# EAGLE design Focus_V7 (EAGLE 6.3)
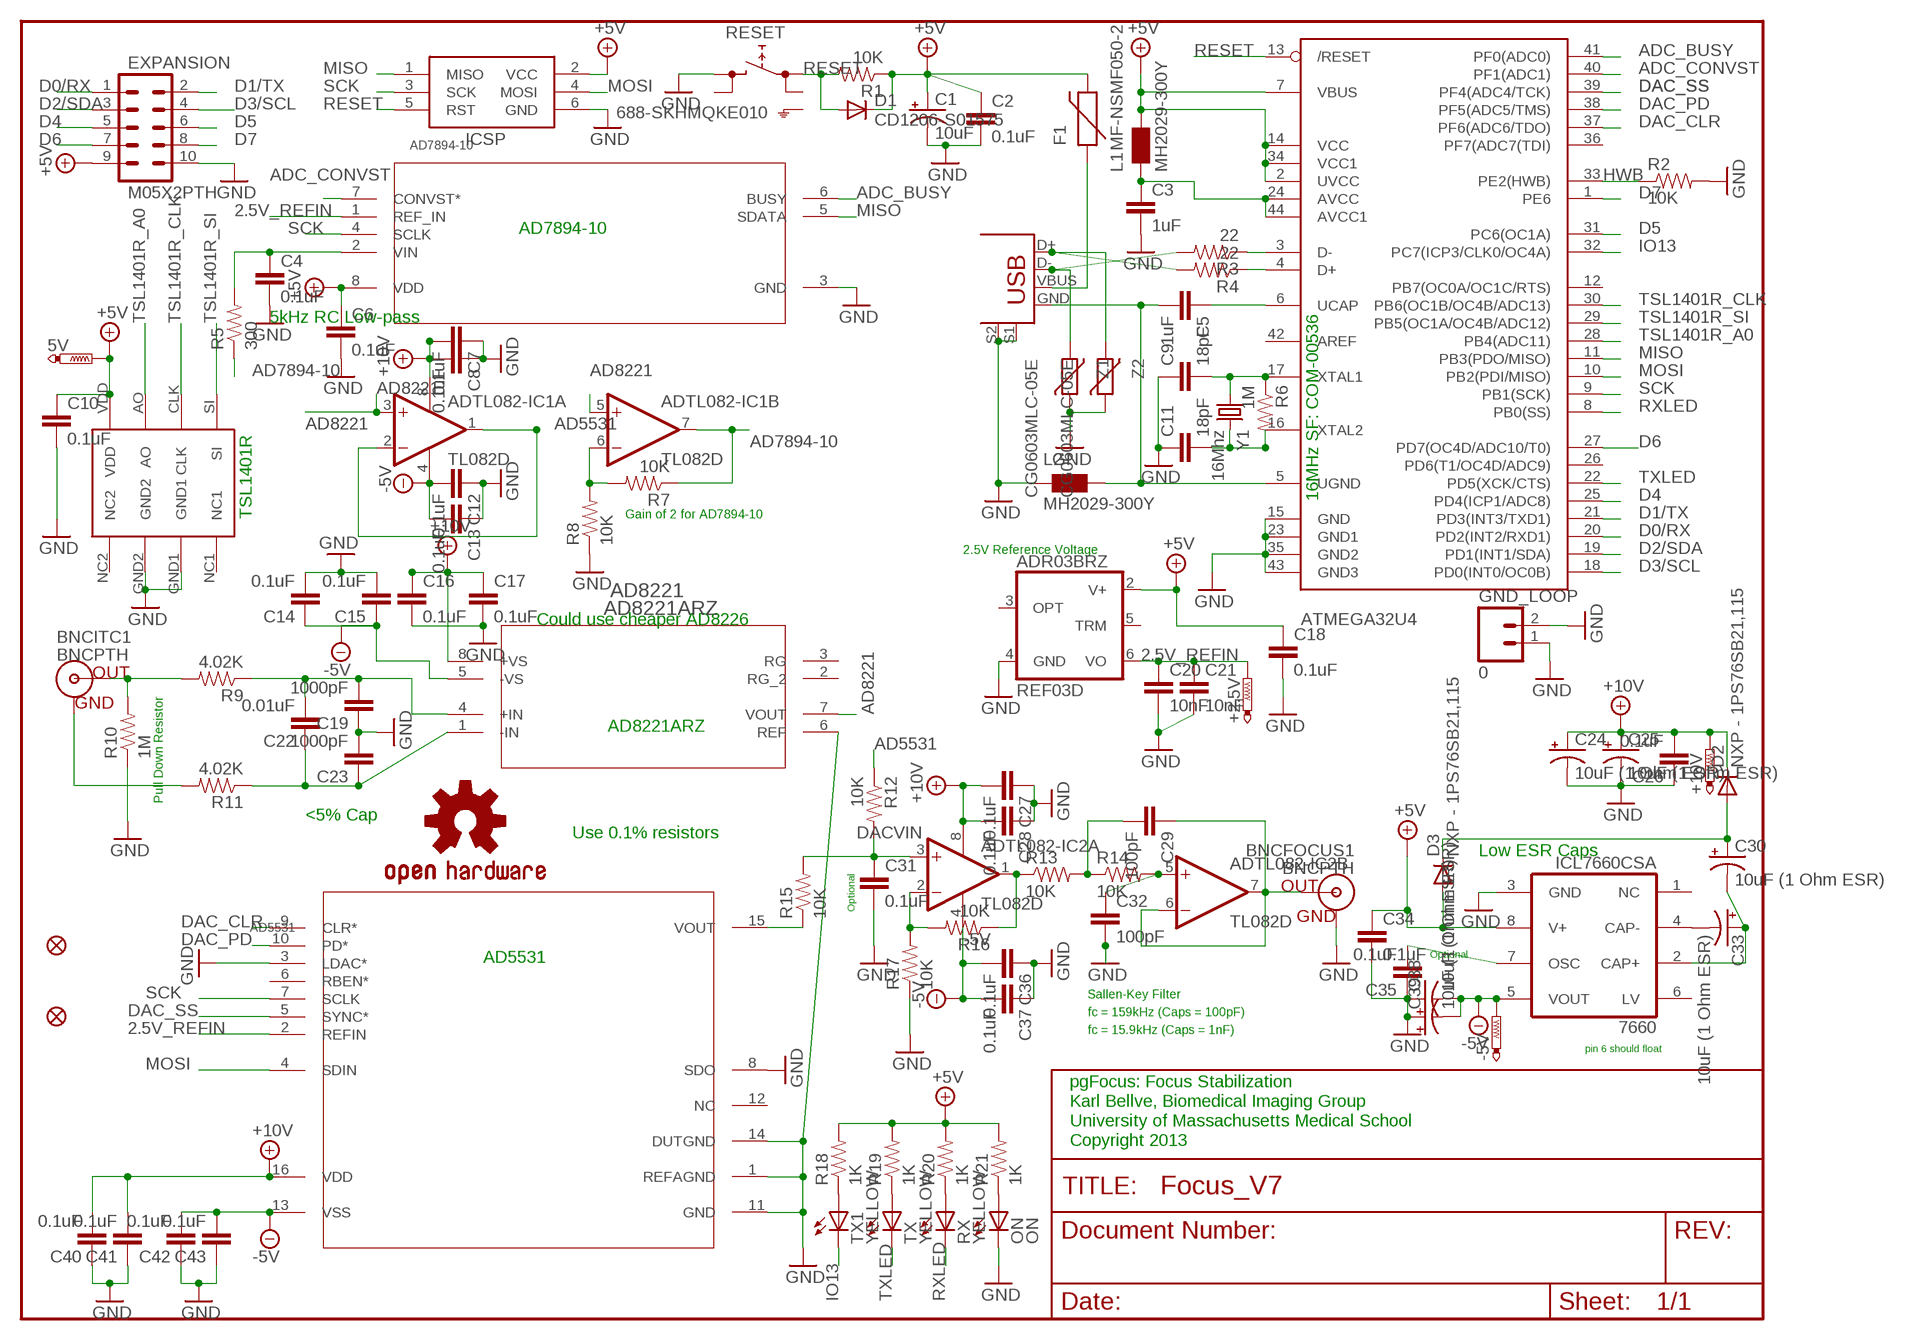
[diagram p0: schematic, sheet 1]

## Parts
5V  PTR1TP20R  [TP20R]
7660  ICL7660CSA  [SO08]
+2.5V  PTR1TP20R  [TP20R]
+10V  PTR1TP20R  [TP20R]
-5V  PTR1TP20R  [TP20R]
AD5531  AD5531BRUZ  [RU_16]
AD7894-10  AD7894ARZ-10  AD7894ARZ-3  [R_8]
AD8221  AD8221ARZ  [R_8]
ADR03BRZ  REF03D  [SO08]
ADTL082-IC1  TL082D  [SO08]
ADTL082-IC2  TL082D  [SO08]
ATMEGA32U4  ATMEGA32U4-AU  [TQFP44]
BNCFOCUS1  BNCPTH  [BNC]
BNCITC1  BNCPTH  [BNC]
C1  10uF  CAP_POL1206-KIT  [EIA3216-KIT]
C2  0.1uF  CAP0603-CAP  [0603-CAP]
C3  1uF  CAP0603-CAP  [0603-CAP]
C4  0.1uF  CAP0603-CAP  [0603-CAP]
C5  1uF  CAP0603-CAP  [0603-CAP]
C6  0.1uF  CAP0603-CAP  [0603-CAP]
C7  0.1uF  CAP0603-CAP  [0603-CAP]
C8  0.1uF  CAP0603-CAP  [0603-CAP]
C9  18pF  CAP0603-CAP  [0603-CAP]
C10  0.1uF  CAP0603-CAP  [0603-CAP]
C11  18pF  CAP0603-CAP  [0603-CAP]
C12  0.1uF  CAP0603-CAP  [0603-CAP]
C13  0.1uF  CAP0603-CAP  [0603-CAP]
C14  0.1uF  CAP0603-CAP  [0603-CAP]
C15  0.1uF  CAP0603-CAP  [0603-CAP]
C16  0.1uF  CAP0603-CAP  [0603-CAP]
C17  0.1uF  CAP0603-CAP  [0603-CAP]
C18  0.1uF  CAP0603-CAP  [0603-CAP]
C19  1000pF  CAP0603-CAP  [0603-CAP]
C20  10nF  CAP0603-CAP  [0603-CAP]
C21  10nF  CAP0603-CAP  [0603-CAP]
C22  0.01uF  CAP0603-CAP  [0603-CAP]
C23  1000pF  CAP0603-CAP  [0603-CAP]
C24  10uF (1 Ohm ESR)  CAP_POL1206-KIT  [EIA3216-KIT]
C25  10uF (1 Ohm ESR)  CAP_POL1206-KIT  [EIA3216-KIT]
C26  0.1uF  CAP0603-CAP  [0603-CAP]
C27  0.1uF  CAP0603-CAP  [0603-CAP]
C28  0.1uF  CAP0603-CAP  [0603-CAP]
C29  100pF  CAP0603-CAP  [0603-CAP]
C30  10uF (1 Ohm ESR)  CAP_POL1206-KIT  [EIA3216-KIT]
C31  0.1uF  CAP0603-CAP  [0603-CAP]
C32  100pF  CAP0603-CAP  [0603-CAP]
C33  10uF (1 Ohm ESR)  CAP_POL1206-KIT  [EIA3216-KIT]
C34  0.1uF  CAP0603-CAP  [0603-CAP]
C35  0.1uF  CAP0603-CAP  [0603-CAP]
C36  0.1uF  CAP0603-CAP  [0603-CAP]
C37  0.1uF  CAP0603-CAP  [0603-CAP]
C38  10uF (1 Ohm ESR)  CAP_POL1206-KIT  [EIA3216-KIT]
C39  10uF (1 Ohm ESR)  CAP_POL1206-KIT  [EIA3216-KIT]
C40  0.1uF  CAP0603-CAP  [0603-CAP]
C41  0.1uF  CAP0603-CAP  [0603-CAP]
C42  0.1uF  CAP0603-CAP  [0603-CAP]
C43  0.1uF  CAP0603-CAP  [0603-CAP]
D1  CD1206-S01575  DIODE-MINIMELF  [MINIMELF]
D2  NXP - 1PS76SB21,115  DIODESOD  [SOD-323]
D3  NXP - 1PS76SB21,115  DIODESOD  [SOD-323]
EXPANSION  M05X2PTH  [AVR_ICSP]
F1  MF-NSMF050-2  PTCSMD  [PTC-1206]
GND_LOOP  0  M02NG  [1X02]
ICSP  AVRISP-6  [AVRISP]
JP1  FIDUCIAL1.5X3  [FIDUCIAL-1.5X3]
JP2  FIDUCIAL1.5X3  [FIDUCIAL-1.5X3]
L1  MH2029-300Y  WE-CBF_0805  [0805]
L2  MH2029-300Y  WE-CBF_0805  [0805]
ON  ON  LEDCHIPLED_0805  [CHIPLED_0805]
R1  10K  RESISTOR0603-RES  [0603-RES]
R2  10K  RESISTOR0603-RES  [0603-RES]
R3  22  RESISTOR0603-RES  [0603-RES]
R4  22  RESISTOR0603-RES  [0603-RES]
R5  300  RESISTOR0603-RES  [0603-RES]
R6  1M  RESISTOR0603-RES  [0603-RES]
R7  10K  RESISTOR0603-RES  [0603-RES]
R8  10K  RESISTOR0603-RES  [0603-RES]
R9  4.02K  RESISTOR0603-RES  [0603-RES]
R10  1M  RESISTOR0603-RES  [0603-RES]
R11  4.02K  RESISTOR0603-RES  [0603-RES]
R12  10K  RESISTOR0603-RES  [0603-RES]
R13  10K  RESISTOR0603-RES  [0603-RES]
R14  10K  RESISTOR0603-RES  [0603-RES]
R15  10K  RESISTOR0603-RES  [0603-RES]
R16  10K  RESISTOR0603-RES  [0603-RES]
R17  10K  RESISTOR0603-RES  [0603-RES]
R18  1K  RESISTOR0603-RES  [0603-RES]
R19  1K  RESISTOR0603-RES  [0603-RES]
R20  1K  RESISTOR0603-RES  [0603-RES]
R21  1K  RESISTOR0603-RES  [0603-RES]
RESET  688-SKHMQKE010  SKHMPSE010  [SKHMPXE010]
RX  YELLOW  LEDCHIPLED_0805  [CHIPLED_0805]
TX  YELLOW  LEDCHIPLED_0805  [CHIPLED_0805]
TX1  YELLOW  LEDCHIPLED_0805  [CHIPLED_0805]
U$1  TSL1401CL  [TSL1401CL]
U$3  OSHW-LOGOL  [OSHW-LOGO-L]
X1  USB+SHIELD  [USB-B-PTH]
Y1  16Mhz  CRYSTALHC49UV  [HC49U-V]
Z1  CG0603MLC-05E  VARISTORCN0603  [CT/CN0603]
Z2  CG0603MLC-05E  VARISTORCN0603  [CT/CN0603]

## Nets
2.5V_REFIN: +2.5V.TP AD5531.2(REFIN) AD7894-10.1(REF_IN) ADR03BRZ.6(VO) C20.1 C21.1
+5V: 5V.TP 7660.8(V+) AD7894-10.8(VDD) ADR03BRZ.2(V+) ATMEGA32U4.2(UVCC) ATMEGA32U4.7(VBUS) ATMEGA32U4.14(VCC) ATMEGA32U4.34(VCC1) C1.A(+) C2.1 C6.1 C10.1 C18.1 C34.1 D1.C D3.2(A) EXPANSION.9 F1.2 ICSP.2(VCC) L1.2 R1.1 R18.2 R19.2 R20.2 R21.2 U$1.VDD
+10V: +10V.TP AD5531.16(VDD) AD8221.8(+VS) ADTL082-IC1.8(P:V+) ADTL082-IC2.8(P:V+) C7.2 C8.2 C16.1 C17.1 C24.A(+) C25.A(+) C26.2 C27.2 C28.2 C40.2 C41.2 D2.1(C)
-5V: 7660.5(VOUT) -5V.TP AD5531.13(VSS) AD8221.5(-VS) ADTL082-IC1.4(P:V-) ADTL082-IC2.4(P:V-) C12.2 C13.2 C14.1 C15.1 C36.2 C37.2 C38.C(-) C39.C(-) C42.2 C43.2
AD5531: ADTL082-IC1.1(A:OUT) ADTL082-IC1.2(A:-IN) R12.1
AD7894-10: ADTL082-IC1.7(B:OUT) R5.1 R7.1
AD8221: AD8221.7(VOUT) ADTL082-IC1.3(A:+IN) ADTL082-IC1.5(B:+IN)
ADC_BUSY: AD7894-10.6(BUSY) ATMEGA32U4.41(PF0(ADC0))
ADC_CONVST: AD7894-10.7(CONVST*) ATMEGA32U4.40(PF1(ADC1))
D0/RX: ATMEGA32U4.20(PD2(INT2/RXD1)) EXPANSION.1
D1/TX: ATMEGA32U4.21(PD3(INT3/TXD1)) EXPANSION.2
D2/SDA: ATMEGA32U4.19(PD1(INT1/SDA)) EXPANSION.3
D3/SCL: ATMEGA32U4.18(PD0(INT0/OC0B)) EXPANSION.4
D4: ATMEGA32U4.25(PD4(ICP1/ADC8)) EXPANSION.5
D5: ATMEGA32U4.31(PC6(OC1A)) EXPANSION.6
D6: ATMEGA32U4.27(PD7(OC4D/ADC10/T0)) EXPANSION.7
D7: ATMEGA32U4.1(PE6) EXPANSION.8
DAC_CLR: AD5531.9(CLR*) ATMEGA32U4.37(PF6(ADC6/TDO))
DAC_PD: AD5531.10(PD*) ATMEGA32U4.38(PF5(ADC5/TMS))
DAC_SS: AD5531.5(SYNC*) ATMEGA32U4.39(PF4(ADC4/TCK))
DACVIN: ADTL082-IC2.3(A:+IN) C31.1 R12.2 R15.2
GND: 7660.3(GND) AD5531.1(REFAGND) AD5531.3(LDAC*) AD5531.8(SDO) AD5531.11(GND) AD5531.14(DUTGND) AD7894-10.3(GND) AD8221.6(REF) ADR03BRZ.4(GND) ATMEGA32U4.15(GND) ATMEGA32U4.23(GND1) ATMEGA32U4.35(GND2) ATMEGA32U4.43(GND3) BNCFOCUS1.GND C1.C(-) C2.2 C3.2 C4.2 C6.2 C7.1 C8.1 C9.1 C10.2 C11.1 C12.1 C13.1 C14.2 C15.2 C16.2 C17.2 C18.2 C19.1 C20.2 C21.2 C23.2 C24.C(-) C25.C(-) C26.1 C27.1 C28.1 C31.2 C32.2 C34.2 C35.1 C36.1 C37.1 C38.A(+) C39.A(+) C40.1 C41.1 C42.1 C43.1 EXPANSION.10 GND_LOOP.1 GND_LOOP.2 ICSP.6(GND) L2.1 ON.CATHODE(C) R2.2 R8.1 R10.1 R17.1 RESET.3(2.1) U$1.GND1 U$1.GND2 X1.S1 X1.S2 Z1.1 Z2.1
HWB: ATMEGA32U4.33(PE2(HWB)) R2.1
IO13: ATMEGA32U4.32(PC7(ICP3/CLK0/OC4A)) TX1.CATHODE(C)
MISO: AD7894-10.5(SDATA) ATMEGA32U4.11(PB3(PDO/MISO)) ICSP.1(MISO)
MOSI: AD5531.4(SDIN) ATMEGA32U4.10(PB2(PDI/MISO)) ICSP.4(MOSI)
N$1: ADTL082-IC2.2(A:-IN) R16.2 R17.2
N$2: ADTL082-IC2.5(B:+IN) C32.1 R14.2
N$3: AD7894-10.2(VIN) C4.1 R5.2
N$4: AD8221.1(-IN) C22.1 C23.1 R11.1
N$5: 7660.7(OSC) C35.2
N$7: ADTL082-IC2.1(A:OUT) R13.1 R16.1
N$8: AD5531.15(VOUT) R15.1
N$9: R19.1 TX.ANODE(A)
N$10: ATMEGA32U4.4(D+) R4.1
N$11: ATMEGA32U4.17(XTAL1) C9.2 R6.1 Y1.1
N$12: R20.1 RX.ANODE(A)
N$13: BNCITC1.GND R11.2
N$14: AD8221.4(+IN) C19.2 C22.2 R9.1
N$15: ATMEGA32U4.6(UCAP) C5.1
N$16: C29.2 R13.2 R14.1
N$17: BNCITC1.S(OUT) R9.2 R10.2
N$18: ADTL082-IC1.6(B:-IN) R7.2 R8.2
N$19: R3.2 X1.D- Z1.2
N$20: ATMEGA32U4.3(D-) R3.1
N$21: R4.2 X1.D+ Z2.2
N$22: F1.1 X1.VBUS
N$23: ADTL082-IC2.6(B:-IN) ADTL082-IC2.7(B:OUT) BNCFOCUS1.S(OUT) C29.1
N$24: ON.ANODE(A) R21.1
N$25: ATMEGA32U4.24(AVCC) ATMEGA32U4.44(AVCC1) C3.1 L1.1
N$26: ATMEGA32U4.16(XTAL2) C11.2 R6.2 Y1.2
N$27: R18.1 TX1.ANODE(A)
N$28: C30.A(+) D2.2(A) D3.1(C)
N$30: 7660.4(CAP-) C33.C(-)
N$31: 7660.2(CAP+) C30.C(-) C33.A(+)
RESET: ATMEGA32U4.13(/RESET) D1.A ICSP.5(RST) R1.2 RESET.1(1.1)
RXLED: ATMEGA32U4.8(PB0(SS)) RX.CATHODE(C)
SCK: AD5531.7(SCLK) AD7894-10.4(SCLK) ATMEGA32U4.9(PB1(SCK)) ICSP.3(SCK)
TSL1401R_A0: ATMEGA32U4.28(PB4(ADC11)) U$1.AO
TSL1401R_CLK: ATMEGA32U4.30(PB6(OC1B/OC4B/ADC13)) U$1.CLK
TSL1401R_SI: ATMEGA32U4.29(PB5(OC1A/OC4B/ADC12)) U$1.SI
TXLED: ATMEGA32U4.22(PD5(XCK/CTS)) TX.CATHODE(C)
UGND: ATMEGA32U4.5(UGND) C5.2 L2.2 X1.GND
Unconnected: 7660.1(NC) 7660.6(LV) AD5531.6(RBEN*) AD5531.12(NC) AD8221.2(RG_2) AD8221.3(RG) ADR03BRZ.3(OPT) ADR03BRZ.5(TRM) ATMEGA32U4.12(PB7(OC0A/OC1C/RTS)) ATMEGA32U4.26(PD6(T1/OC4D/ADC9)) ATMEGA32U4.36(PF7(ADC7(TDI)) ATMEGA32U4.42(AREF) RESET.2(1.2) RESET.4(2.2) RESET.5(SH) U$1.NC1 U$1.NC2

## Notes on the sheet
- AD7894-10
- 5kHz RC Low-pass
- 16MHz SF: COM-00536
- TSL1401R | Gain of 2 for AD7894-10
- 2.5V Reference Voltage
- Could use cheaper AD8226
- AD8221ARZ
- Pull Down Resistor
- <5% Cap
- Use 0.1% resistors
- Low ESR Caps
- Optional
- Optional
- AD5531
- Sallen-Key Filter
- fc = 159kHz (Caps = 100pF)
- fc = 15.9kHz (Caps = 1nF)
- pin 6 should float
- pgFocus: Focus Stabilization
- Karl Bellve, Biomedical Imaging Group
- University of Massachusetts Medical School
- Copyright 2013

## Library data of the parts
5V +2.5V +10V -5V = testpad:PTR1: TEST PIN
7660 = maxim:ICL7660CSA: VOLTAGE CONVERTER; MF: MAXIM; MPN: ICL7660CSA; OC_FARNELL: 9724710; OC_NEWARK: 34C3732
AD5531 = BIG:AD5531BRUZ; MANUFACTURER_PART_NUMBER: AD5531BRUZ; VENDOR: Vendor
AD7894-10 = BIG:AD7894ARZ-3; MANUFACTURER_PART_NUMBER: AD7894ARZ-3; VENDOR: Vendor
AD8221 = BIG:AD8221ARZ
ADR03BRZ = linear:REF03: VOLTAGE REFERENCE
ADTL082-IC1 ADTL082-IC2 = linear:TL082: OP AMP
ATMEGA32U4 = adafruit:ATMEGA32U4: http://www.ladyada.net/library/eagle
BNCFOCUS1 BNCITC1 = SparkFun:BNC: BNC Connector, Mouser Part# 5227161
C1 C24 C25 C30 C33 C38 C39 = SparkFun:CAP_POL: Capacitor Polarized These are standard SMD and PTH capacitors. Normally 10uF, 47uF, and 100uF in electrolytic and tantalum varieties. Always verify the external diameter of the through hole cap, it varies with capacity, voltage, and manufacturer. The EIA devices should be standard.
C2-C23 C26-C29 C31 C32 C34-C37 C40-C43 = SparkFun:CAP: Capacitor Standard 0603 ceramic capacitor, and 0.1" leaded capacitor.
D1 = diode:DIODE-: DIODE
D2 D3 = SparkFun:DIODE: Diode These are standard reverse protection diodes and small signal diodes. SMA package can handle up to about 1A. SOD-323 can handle about 200mA. What the SOD-323 package when ordering, there are some mfgs out there that are 5-pin packages.
EXPANSION = SparkFun:M05X2: Header 5x2 Standard 10-pin dual row 0.1" header. Commonly used with AVR-ISP. Use with Spark Fun Electronics SKU: PRT-00778
F1 = SparkFun:PTC: Resettable Fuse PTC Resettable Fuse. Spark Fun Electronics SKU : COM-08357
GND_LOOP = SparkFun:M02NG
ICSP = adafruit:AVRISP: AVR ISP HEADER Standard 6 pin header for AVR programming
JP1 JP2 = SparkFun:FIDUCIAL: Fiducial Alignment Points Various fiducial points for machine vision alignment.
L1 L2 = wuerth-elektronik:WE-CBF: SMD EMI Suppression Ferrite Beads - excellent anti-EMI properties - low DCR - impedances till 3000 ohms - rated current up to 6 A
ON RX TX TX1 = BIG:LED: LED OSRAM: - CHIPLED LG R971, LG N971, LY N971, LG Q971, LY Q971, LO R971, LY R971 LH N974, LH R974 LS Q976, LO Q976, LY Q976 LO Q996 - Hyper CHIPLED LW Q18S LB Q993, LB Q99A, LB R99A - SideLED LS A670, LO A670, LY A670, LG A670, LP A670 LB A673, LV A673, LT A673, LW A673 LH A674 LY A675 LS A676, LA A676, LO A676, LY A676, LW A676 LS A679, LY A679, LG A679 - Hyper Micro SIDELED® LS Y876, LA Y876, LO Y876, LY Y876 LT Y87S - SmartLED LW L88C, LW L88S LB L89C, LB L89S, LG L890 LS L89K, LO L89K, LY L89K LS L896, LA L896, LO L896, LY L896 - TOPLED LS T670, LO T670, LY T670, LG T670, LP T670 LSG T670, LSP T670, LSY T670, LOP T670, LYG T670 LG T671, LOG T671, LSG T671 LB T673, LV T673, LT T673, LW T673 LH T674 LS T676, LA T676, LO T676, LY T676, LB T676, LH T676, LSB T676, LW T676 LB T67C, LV T67C, LT T67C, LS T67K, LO T67K, LY T67K, LW E67C LS E67B, LA E67B, LO E67B, LY E67B, LB E67C, LV E67C, LT E67C LW T67C LS T679, LY T679, LG T679 LS T770, LO T770, LY T770, LG T770, LP T770 LB T773, LV T773, LT T773, LW T773 LH T774 LS E675, LA E675, LY E675, LS T675 LS T776, LA T776, LO T776, LY T776, LB T776 LHGB T686 LT T68C, LB T68C - Hyper Mini TOPLED® LB M676 - Mini TOPLED Santana® LG M470 LS M47K, LO M47K, LY M47K Source: http://www.osram.convergy.de LUXEON: - LUMILED® LXK2-PW12-R00, LXK2-PW12-S00, LXK2-PW14-U00, LXK2-PW14-V00 LXK2-PM12-R00, LXK2-PM12-S00, LXK2-PM14-U00 LXK2-PE12-Q00, LXK2-PE12-R00, LXK2-PE12-S00, LXK2-PE14-T00, LXK2-PE14-U00 LXK2-PB12-K00, LXK2-PB12-L00, LXK2-PB12-M00, LXK2-PB14-N00, LXK2-PB14-P00, LXK2-PB14-Q00 LXK2-PR12-L00, LXK2-PR12-M00, LXK2-PR14-Q00, LXK2-PR14-R00 LXK2-PD12-Q00, LXK2-PD12-R00, LXK2-PD12-S00 LXK2-PH12-R00, LXK2-PH12-S00 LXK2-PL12-P00, LXK2-PL12-Q00, LXK2-PL12-R00 Source: www.luxeon.com KINGBRIGHT: KA-3528ASYC Source: www.kingbright.com
R1-R21 = SparkFun:RESISTOR: Resistor Basic schematic elements and footprints for 0603, 1206, and PTH resistors.
RESET = switch:SKHMP*E010: 6.2 X 6.5mm TACT Switch (SMD) Source: http://www3.alps.co.jp/WebObjects/catalog.woa/PDF/E/Switch/Tact/SKHM/SKHM.PDF
U$1 = BIG:TSL1401: 128 x 1 Linear Sensor Array with Hold The TSL1401 linear sensor array consists of a 128 × 1 array of photodiodes, associated charge amplifier circuitry, and an internal pixel data-hold function that provides simultaneous-integration start and stop times for all pixels. The array is made up of 128 pixels, each of which has a photo-sensitive area of 3,524.3 square micrometers. There is 8-?m spacing between pixels. Operation is simplified by internal control logic that requires only a serial-input (SI) signal and a clock.
U$3 = SparkFun:OSHW-LOGO: Open Source Hardware Logo This logo indicates the piece of hardware it is found on incorporates a OSHW license and/or adheres to the definition of open source hardware found here: http://freedomdefined.org/OSHW
X1 = SparkFun:USB+SHIELD: USB+Shield USB connector with shield pins connectable
Y1 = SparkFun:CRYSTAL: Crystals Various standard crystals. Proven footprints. Spark Fun Electronics SKU : COM-00534
Z1 Z2 = varistor:VARISTOR: VARISTOR

## Board
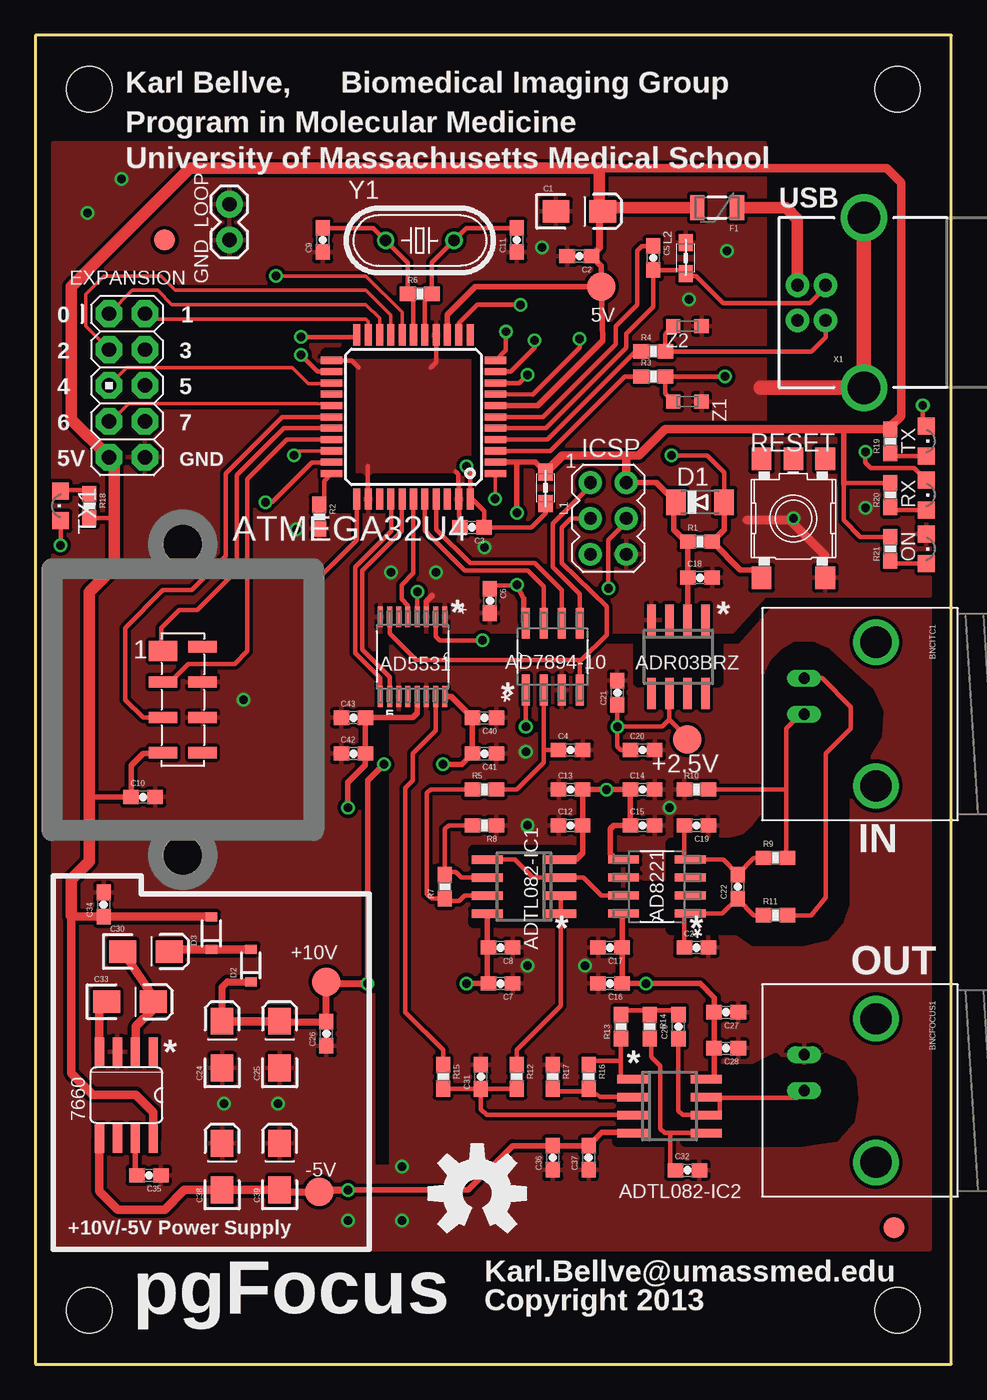
[diagram p1: board, top side]
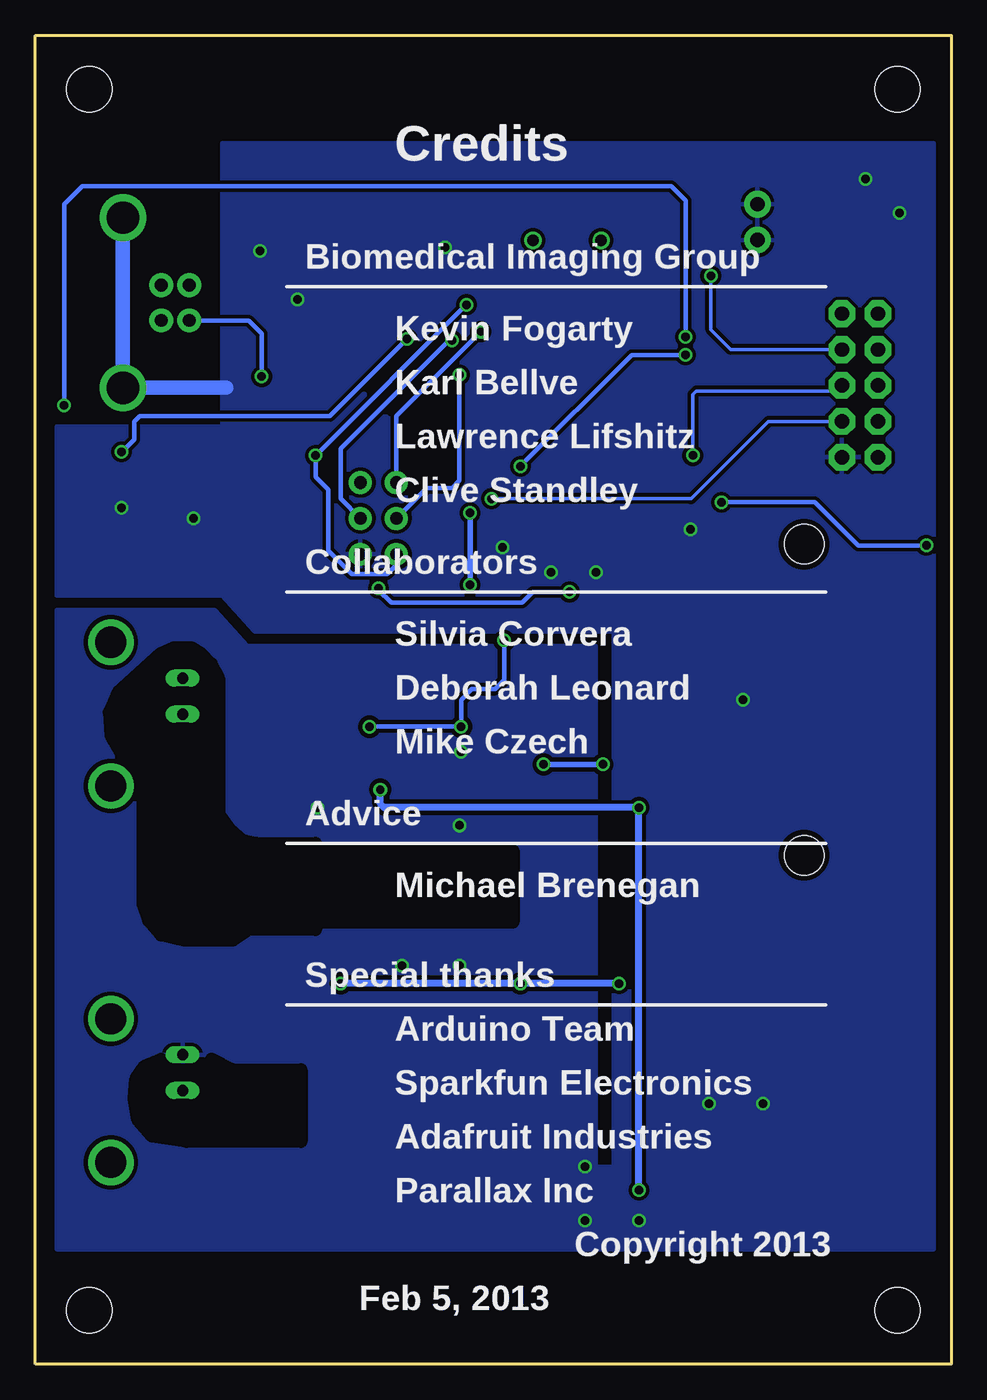
[diagram p2: board, bottom side, seen from below]

Size 64.77 x 93.98 mm. Coordinates in mm from the lower left corner, seen from the top.
Outline: 0,0 64.77,0 64.77,93.98 0,93.98 0,0
Copper layers (1*16): Top 0.0356mm / dielectric 1.5011mm / Bottom 0.0356mm
Design rules "LaenPCBOrder": minimum track width 6mil, minimum drill 13mil, track to track 6mil, track to pad 6mil, pad to pad 6mil, via to via 6mil, smd to smd 6mil, copper to edge 15mil, drill to drill 6mil, minimum pad ring 7mil, minimum via ring 7mil, stop-mask expansion 4mil, vias tented up to drill 0mil, thermal gap 10mil
Holes 3.2 mm at 60.96,90.17 3.81,90.17 3.81,3.81 60.96,3.81
tRestrict: 54 lines
bRestrict: 39 lines

### Footprints (pad centres in the part's own frame; a part is rotated, then mirrored left to right if it is on the bottom)
TP20R = smd 2 x 2: TP 0,0
SO08 = smd 0.66 x 2.032: 1 -1.905,-3.073; 2 -0.635,-3.073; 3 0.635,-3.073; 4 1.905,-3.073; 5 1.905,3.073; 6 0.635,3.073; 7 -0.635,3.073; 8 -1.905,3.073
RU_16 = smd 1.473 x 0.356: 1 -2.819,2.286; 2 -2.819,1.626; 3 -2.819,0.965; 4 -2.819,0.33; 5 -2.819,-0.33; 6 -2.819,-0.965; 7 -2.819,-1.626; 8 -2.819,-2.286; 9 2.819,-2.286; 10 2.819,-1.626; 11 2.819,-0.965; 12 2.819,-0.33; 13 2.819,0.33; 14 2.819,0.965; 15 2.819,1.626; 16 2.819,2.286
R_8 = smd 2.184 x 0.559: 1 -2.362,1.905; 2 -2.362,0.635; 3 -2.362,-0.635; 4 -2.362,-1.905; 5 2.362,-1.905; 6 2.362,-0.635; 7 2.362,0.635; 8 2.362,1.905
SO08' = smd 0.6 x 2.2: 1 -1.905,-2.6; 2 -0.635,-2.6; 3 0.635,-2.6; 4 1.905,-2.6; 5 1.905,2.6; 6 0.635,2.6; 7 -0.635,2.6; 8 -1.905,2.6
TQFP44 = smd 1.5 x 0.5: 1 -5.8,4; 2 -5.8,3.2; 3 -5.8,2.4; 4 -5.8,1.6; 5 -5.8,0.8; 6 -5.8,0; 7 -5.8,-0.8; 8 -5.8,-1.6; 9 -5.8,-2.4; 10 -5.8,-3.2; 11 -5.8,-4; 23 5.8,-4; 24 5.8,-3.2; 25 5.8,-2.4; 26 5.8,-1.6; 27 5.8,-0.8; 28 5.8,0; 29 5.8,0.8; 30 5.8,1.6; 31 5.8,2.4; 32 5.8,3.2; 33 5.8,4 | smd 0.5 x 1.5: 12 -4,-5.8; 13 -3.2,-5.8; 14 -2.4,-5.8; 15 -1.6,-5.8; 16 -0.8,-5.8; 17 0,-5.8; 18 0.8,-5.8; 19 1.6,-5.8; 20 2.4,-5.8; 21 3.2,-5.8; 22 4,-5.8; 34 4,5.8; 35 3.2,5.8; 36 2.4,5.8; 37 1.6,5.8; 38 0.8,5.8; 39 0,5.8; 40 -0.8,5.8; 41 -1.6,5.8; 42 -2.4,5.8; 43 -3.2,5.8; 44 -4,5.8
BNC = drill 2.2: 3 -5.08,5.08; 4 5.08,5.08 | drill 0.8 long: GND -2.54,0; S 0,0
EIA3216-KIT = smd 1.9 x 1.6: A 1.65,0; C -1.65,0
0603-CAP = smd 1.1 x 1: 1 -0.85,0; 2 0.85,0
MINIMELF = smd 1.4 x 1.8: A 1.7,0; C -1.7,0
SOD-323 = smd 0.63 x 0.83: 1 -1.15,0; 2 1.15,0
AVR_ICSP = drill 1.016 pad 1.88 octagon: 1 -1.27,5.08; 2 1.27,5.08; 3 -1.27,2.54; 4 1.27,2.54; 5 -1.27,0; 6 1.27,0; 7 -1.27,-2.54; 8 1.27,-2.54; 9 -1.27,-5.08; 10 1.27,-5.08
PTC-1206 = smd 1 x 1.8: 1 -1.4,0; 2 1.4,0
1X02 = drill 1.016 pad 1.88: 1 0,0; 2 2.54,0
AVRISP = drill 0.9 pad 1.626: 1 -1.27,2.54; 2 1.27,2.54; 3 -1.27,0; 4 1.27,0; 5 -1.27,-2.54; 6 1.27,-2.54
FIDUCIAL-1.5X3 = smd 1.5 x 1.5: 1 0,0
0805 = smd 1.2 x 1: 1 -1.1,0; 2 1.1,0
CHIPLED_0805 = smd 1.2 x 1.2: ANODE 0,-1.05; CATHODE 0,1.05
0603-RES = smd 1.1 x 1: 1 -0.85,0; 2 0.85,0
SKHMPXE010 = smd 1.6 x 1.4: 1 -4.2,2.25; 2 4.2,2.25; 3 -4.2,-2.25; 4 4.2,-2.25; 5 4.2,0
TSL1401CL = smd 2 x 0.8: AO -1.4,-1.25; CLK -1.4,1.25; GND1 1.4,1.25; GND2 1.4,-1.25; NC1 1.4,3.75; NC2 1.4,-3.75; VDD -1.4,-3.75 | smd 2 x 1.4: SI -1.4,3.45 | hole 2.8: 0,11; 0,-11
USB-B-PTH = drill 0.914 pad 1.676: D+ 0,1.25; D- 1.981,1.25; GND 0,-1.25; VBUS 1.981,-1.25 | drill 2.286: S1 -2.718,-6.02; S2 -2.718,6.02
HC49U-V = drill 0.813: 1 -2.413,0; 2 2.413,0
CT/CN0603 = smd 1 x 1: 1 -1,0; 2 1,0

### Placement (x,y rotation side)
5V  40,76.2 0 top
7660  6.43,19.02 180 top
+2.5V  46.1,44.2 0 top
+10V  20.57,27.05 0 top
-5V  20.07,12.19 0 top
AD5531  26.67,50.04 270 top
AD7894-10  36.58,50.04 90 top
AD8221  43.94,33.78 180 top
ADR03BRZ  REF03D  [SO08']  45.47,50.04 180 top
ADTL082-IC1  TL082D  [SO08']  34.54,33.78 90 top
ADTL082-IC2  TL082D  [SO08']  44.83,18.25 270 top
ATMEGA32U4  26.73,66.99 180 top
BNCFOCUS1  54.36,19.35 270 top
BNCITC1  54.36,45.97 270 top
C1  38.46,81.53 0 top
C2  38.46,78.36 180 top
C3  30.86,59.18 180 top
C4  37.85,43.43 0 top
C5  43.69,78.23 270 top
C6  32.13,53.98 270 top
C7  32.89,26.92 180 top
C8  32.89,29.46 180 top
C9  20.32,79.5 90 top
C10  7.62,40.11 0 top
C11  34.04,79.5 90 top
C12  37.85,38.1 0 top
C13  37.85,40.64 0 top
C14  42.93,40.64 0 top
C15  42.93,38.1 0 top
C16  40.64,26.92 180 top
C17  40.64,29.46 180 top
C18  46.99,55.63 0 top
C19  46.74,38.1 180 top
C20  42.93,43.43 0 top
C21  41.15,47.5 90 top
C22  49.66,33.78 90 top
C23  46.74,29.46 0 top
C24  13.21,22.61 90 top
C25  17.27,22.61 90 top
C26  20.57,23.37 90 top
C27  48.84,24.89 180 top
C28  48.84,22.35 180 top
C29  45.47,23.88 90 top
C30  7.83,29.19 0 top
C31  31.5,20.32 90 top
C32  46.1,13.72 0 top
C33  6.69,25.63 0 top
C34  4.83,32.51 90 top
C35  8.03,13.36 180 top
C36  36.58,14.61 90 top
C37  39.12,14.61 90 top
C38  13.21,13.97 90 top
C39  17.27,13.97 90 top
C40  31.75,45.72 180 top
C41  31.75,43.18 180 top
C42  22.48,43.18 0 top
C43  22.48,45.72 0 top
D1  46.99,60.96 0 top
D2  15.24,28.19 90 top
D3  12.45,30.48 90 top
EXPANSION  6.48,69.21 0 top
F1  48.21,81.79 180 top
GND_LOOP  13.72,82.04 270 top
ICSP  40.51,59.82 0 top
JP1  60.71,9.65 0 top
JP2  9.14,79.5 0 top
L1  36.07,61.98 90 top
L2  45.97,78.23 270 top
ON  62.99,57.66 0 top
R1  46.99,58.17 0 top
R2  20.07,59.94 270 top
R3  43.69,69.85 0 top
R4  43.69,71.63 0 top
R5  31.75,40.64 0 top
R6  27.18,75.69 0 top
R7  28.96,33.78 90 top
R8  31.75,38.1 180 top
R9  52.32,35.81 0 top
R10  46.74,40.64 0 top
R11  52.32,31.75 0 top
R12  34.04,20.32 270 top
R13  41.4,23.86 90 top
R14  43.43,23.88 270 top
R15  28.83,20.32 270 top
R16  39.12,20.32 270 top
R17  36.58,20.32 270 top
R18  3.81,60.71 270 top
R19  60.45,65.28 90 top
R20  60.45,61.47 90 top
R21  60.45,57.66 90 top
RESET  53.59,59.82 90 top
RX  62.99,61.47 0 top
TX  62.99,65.28 0 top
TX1  1.78,60.71 180 top
U$1  10.42,46.99 0 top
U$3  31.24,12.06 0 top
X1  55.86,75.07 180 top
Y1  27.18,79.47 0 top
Z1  46.1,68.07 180 top
Z2  46.1,73.41 180 top

### Tracks (layer width: path | path; a pad name or v marks a point on that pad's centre or on a via)
2.5V_REFIN  (via drill 0.6)
  Top 0.305: v34.67,45.09 AD7894-10.1 | AD5531.2 28.3,51.46 28.58,51.18 v31.62,51.18 | v41.15,45.09 44.32,45.09 44.83,45.59 | 44.83,45.59 ADR03BRZ.6 | v41.15,45.09 C21.1 | +2.5V.TP 46.1,44.32 44.83,45.59 | v41.15,45.09 41.15,43.68 41.4,43.43 C20.1
  Bottom 0.305: v41.15,45.09 v34.67,45.09 34.67,46.99 33.91,47.75 32.26,47.75 31.62,48.39 v31.62,51.18
+5V  (via drill 0.6)
  Top 0.305: 33.86,55.07 32.17,55.07 C6.1 | R18.2 5.42,59.86 5.59,59.69 | R21.2 58.33,58.51 57.15,59.69 57.15,62.23 57.24,62.32 R20.2 | ATMEGA32U4.34 22.73,58.29 19.68,55.25 19.68,38.74 19.05,38.1 3.81,38.1
  Top 0.406: ATMEGA32U4.2 34.04,63.79 | 34.04,63.79 v34.04,60.2 | AD7894-10.8 34.54,52.53 34.54,54.13 v34.04,55.12 33.86,55.07 | 3.81,40.13 3.83,40.11 C10.1 6.77,42.33 7.62,43.18 8.96,43.18 U$1.VDD | 60.45,66.29 R19.2 | 57.15,66.13 57.15,62.23 | ICSP.2 43.89,62.36 D1.C | 45.12,60.79 45.12,59.02 45.72,58.42 45.89,58.42 R1.1 C18.1 46.14,52.68 ADR03BRZ.2 | 41.78,64.14 41.91,64.26 | 34.04,63.79 35.35,63.79 L1.2 | ATMEGA32U4.14 29.13,74.22 31.11,76.2 5V.TP | ATMEGA32U4.7 35.53,67.79 40.13,72.39 5V.TP | 5V.TP 40,77.66 C2.1
  Top 0.508: 2.54,31.75 2.63,31.66 | 5.59,63.75 EXPANSION.9 | 40.39,81.79 39.88,81.91 | 39.88,81.79 39.88,81.49 | 39.88,81.49 C1.A | 39.88,81.49 39.88,78.93 C2.1
  Top 0.61: 41.78,64.14 ICSP.2 | 60.45,66.29 61.21,67.06 61.21,83.57 60.2,84.58 39.88,84.58 | 2.54,31.75 2.54,20.57 4.06,19.05 7.11,19.05 8.34,17.82 7660.8 | 45.12,60.79 D1.C | R19.2 57.15,66.13 44.54,66.13 42.67,64.26 41.91,64.26 37.25,64.26 L1.2 | 2.63,31.66 C34.1 12.41,31.66 D3.2
  Top 0.813: F1.2 40.39,81.79 39.88,81.79 39.88,81.91 39.88,84.58 10.92,84.58 2.54,76.2 2.54,66.8 EXPANSION.9 | 2.54,31.75 2.54,34.29 3.81,35.56 3.81,38.1 3.81,40.13 3.81,54.61 5.59,56.39 5.59,59.69 5.59,63.75
  Bottom 0.406: v34.04,60.2 v34.04,55.12
+10V  (via drill 0.6)
  Top 0.305: 20.48,24.22 C26.2
  Top 0.406: ADTL082-IC2.8 47.46,20.19 48.01,20.19 47.99,20.2 C28.2 C27.2 48.01,24.9 48.01,25.91 46.99,26.92 v43.18,26.92 C16.1 C17.1 41.49,31.79 AD8221.8 | 31.94,29.46 31.94,27.02 C7.2 v30.48,26.92 | 31.94,29.46 ADTL082-IC1.8 | 31.94,29.46 C8.2 | AD5531.16 29.4,47.22 C40.2 C41.2 30.14,42.42 v28.83,42.42 | v23.49,26.92 23.49,41.28 v24.64,42.42
  Top 0.508: D2.1 13.58,27.04 13.21,26.67 C24.A | 17.27,24.38 C25.A 17.34,24.22 20.48,24.22 | v23.49,26.92 20.7,26.92 +10V.TP C26.2
  Top 0.61: C24.A C25.A
  Bottom 0.406: v24.64,42.42 v28.83,42.42
  Bottom 0.508: v23.49,26.92 v30.48,26.92 v43.18,26.92
-5V  (via drill 0.6)
  Top 0.254: 42.2,16.38 ADTL082-IC2.4
  Top 0.406: ADTL082-IC1.4 38.23,35.69 38.7,36.16 C12.2 C13.2 v40.39,40.64 C14.1 C15.1 40.89,38.1 40.64,37.85 40.64,36.07 41.02,35.69 AD8221.5 | AD5531.13 27,46.05 26.67,45.72 C43.2 C42.2 23.33,42.38 22.1,41.15 v22.1,39.37 | v22.1,12.32 30.61,12.32 33.74,15.46 C36.2 C37.2 40.04,16.38 42.2,16.38
  Top 0.508: C39.C 17.4,12.19 -5V.TP 21.08,12.32 v22.1,12.32
  Top 0.61: C39.C C38.C 10.54,12.32 9.14,10.92 5.84,10.92 4.53,12.24 7660.5
  Bottom 0.508: v40.39,40.64 40.39,39.62 40.13,39.37 v22.1,39.37 v22.1,12.32
AD5531
  Top 0.305: ADTL082-IC1.2 ADTL082-IC1.1 37.14,25.33 34.04,22.22 R12.1
AD7894-10
  Top 0.305: ADTL082-IC1.7 30.35,33.15 29.97,32.77 29.25,32.77 | R7.1 28.03,32.93 27.69,33.27 27.69,40.39 27.94,40.64 R5.1
  Top 0.406: R7.1 29.25,32.77
AD8221
  Top 0.305: AD8221.7 40,33.15 38.73,34.42 ADTL082-IC1.3 35.18,34.42 33.91,35.69 ADTL082-IC1.5
ADC_BUSY
  Top 0.305: ATMEGA32U4.41 28.33,59.04 30.73,56.64 35.31,56.64 37.21,54.74 AD7894-10.6
ADC_CONVST
  Top 0.305: ATMEGA32U4.40 27.53,58.95 30.35,56.13 34.8,56.13 35.94,54.99 AD7894-10.7
D0/RX
  Top 0.254: EXPANSION.1 6.86,75.95 8.64,75.95 9.65,74.93 23.37,74.93 24.33,73.96 ATMEGA32U4.20
D1/TX
  Top 0.254: ATMEGA32U4.21 23.53,73.75 23.37,73.91 8.13,73.91 EXPANSION.2
D2/SDA
  Top 0.254: EXPANSION.3 3.56,73.41 3.56,75.69 4.83,76.96 8.89,76.96 9.91,75.95 23.37,75.95 25.13,74.18 ATMEGA32U4.19
D3/SCL  (via drill 0.6)
  Top 0.254: v17.02,76.96 23.37,76.96 25.93,74.4 ATMEGA32U4.18
  Bottom 0.254: v17.02,76.96 17.02,73.15 15.62,71.75 EXPANSION.4
D4
  Top 0.254: EXPANSION.5 6.48,70.48 18.16,70.48 19.3,69.34 20.88,69.34 ATMEGA32U4.25
D5  (via drill 0.6)
  Top 0.254: ATMEGA32U4.31 18.62,64.59 v18.29,64.26
  Bottom 0.254: EXPANSION.6 8,69.21 8.38,68.83 18.03,68.83 18.29,68.58 v18.29,64.26
D6
  Top 0.254: 5.33,66.67 6.6,67.94 19.94,67.94 ATMEGA32U4.27
  Top 0.305: EXPANSION.7 5.33,66.67 | 20.91,67.82 ATMEGA32U4.27
D7  (via drill 0.6)
  Top 0.254: v32.51,61.21 32.51,62.97
  Top 0.305: 32.51,62.97 ATMEGA32U4.1
  Bottom 0.254: v32.51,61.21 18.41,61.21 12.95,66.67 EXPANSION.8
DAC_CLR
  Top 0.305: ATMEGA32U4.37 25.15,61.18 25.15,58.93 22.61,56.39 22.61,50.29 24.38,48.51 AD5531.9
DAC_PD
  Top 0.305: ATMEGA32U4.38 25.91,61.17 25.91,58.93 23.11,56.13 23.11,50.55 25.04,48.62 AD5531.10
DAC_SS
  Top 0.305: ATMEGA32U4.39 26.73,55.94 25.91,55.12 25.91,54.1 26.34,53.67 AD5531.5
DACVIN
  Top 0.305: R15.2 C31.1 | C31.1 R12.2 | ADTL082-IC2.3 33.71,17.63 31.9,17.63 31.5,18.03 C31.1
GND  (via drill 0.6)
  Top 0.305: ATMEGA32U4.23 22.35,70.99 22.86,70.48 | ATMEGA32U4.15 28.33,70.88 27.94,70.48 | C3.2 29.88,62.95 29.72,63.12 | 23.49,61.6 23.49,63.5
  Top 0.406: 55.75,55.53 RESET.3 | AD5531.3 27.63,53.92 28.07,54.36
  Top 0.61: 55.84,57.19 53.34,59.69 50.29,59.69 | 55.88,55.88 55.84,55.84 RESET.3 55.88,55.12
  Top 1.016: X1.S1 X1.S2 51.27,69.05
  Bottom 1.016: X1.S1 X1.S2 51.27,69.05
  other vias: 22.1,10.16 25.15,56.01 34.8,28.19 38.86,28.19 18.47,59.05 31.75,57.79 14.73,46.99 34.67,43.31 46.23,75.31 48.89,78.74 3.68,81.41 6.1,83.82 25.91,13.97 25.91,10.16 28.32,56.01 17.14,18.41 58.67,60.58 53.59,59.82 35.81,78.99 13.34,18.41 34.8,38.1 44.83,39.37
  pour Top (isolate 0.254): 23.88,51.82 49.28,51.82 51.56,54.36 63.25,54.36 63.25,66.29 51.56,66.29 51.56,86.36 1.27,86.36 1.27,8.13 23.88,8.13
  pour Bottom (isolate 0.254): 1.27,86.36 51.56,86.36 51.56,66.29 63.25,66.29 63.25,54.36 51.56,54.36 49.28,51.82 23.88,51.82 23.88,8.13 1.27,8.13
  pour Bottom (isolate 0.305): 25.15,50.8 49.78,50.8 52.07,53.34 63.25,53.34 63.25,8.13 21.34,8.13 21.34,13.97 25.15,13.97
  pour Top (isolate 0.254): 25.15,50.8 49.78,50.8 52.07,53.34 63.25,53.34 63.25,8.13 21.34,8.13 21.34,13.97 25.15,13.97
HWB
  Top 0.254: R2.1 20.41,61.23
  Top 0.305: 20.41,61.23 20.41,62.47 ATMEGA32U4.33
IO13  (via drill 0.6)
  Top 0.305: TX1.CATHODE v1.78,57.91 | v16.26,60.96 16.76,60.96 19.56,63.75 20.9,63.75 ATMEGA32U4.32
  Bottom 0.305: v16.26,60.96 9.65,60.96 6.6,57.91 v1.78,57.91
MISO  (via drill 0.6)
  Top 0.305: v33.27,73.02 33.27,71.73 ATMEGA32U4.11 | AD7894-10.5 38.48,54.48 36.58,56.39 36.58,59.44 39.24,62.1 ICSP.1
  Bottom 0.305: ICSP.1 39.24,67.06 v33.27,73.02
MOSI  (via drill 0.6)
  Top 0.305: AD5531.4 v27,54.61 | ATMEGA32U4.10 33.62,70.19 35.31,71.88 v35.31,72.39 | ICSP.4 41.78,59.56 40.51,58.29 v40.51,54.86
  Bottom 0.305: ICSP.4 43.18,61.21 43.18,64.77 35.56,72.39 v35.31,72.39 | v27,54.61 29.59,54.61 30.35,53.85 39.62,53.85 40.51,54.74 v40.51,54.86
N$1
  Top 0.305: ADTL082-IC2.2 39.95,18.89 R16.2 39.2,19.3 36.45,19.3 36.32,19.43 R17.2
N$2
  Top 0.305: C32.1 44.9,13.72 44.9,16.28 44.83,16.35 | 44.83,16.35 44.48,16.35 44.2,16.64 44.2,21.08 43.56,21.72 43.56,22.91 R14.2 | 44.83,16.35 ADTL082-IC2.5
N$3
  Top 0.305: 35.94,43.43 35.94,42.55 34.04,40.64 R5.2 | 35.94,43.43 AD7894-10.2 | 35.94,43.43 C4.1
N$4
  Top 0.305: C23.1 45.89,31.84 45.72,32 46.18,32 AD8221.1 48.56,31.88 C22.1 49.66,32.89 50.8,31.75 R11.1
N$5
  Top 0.406: 7660.7 7.07,13.47 C35.2
N$7
  Top 0.305: 41.4,21.34 41.4,20.19 42.2,20.19 ADTL082-IC2.1 | 41.4,21.34 R13.1 | R16.1 39.37,21.46 41.27,21.46 41.4,21.34
N$8
  Top 0.305: AD5531.15 28.3,44.81 26.67,43.18 26.67,41.28 26.16,40.77 26.16,24.89 28.83,22.22 R15.1
N$9
  Top 0.305: 60.65,64.23 TX.ANODE
  Top 0.406: R19.1 60.65,64.23
N$10
  Top 0.305: ATMEGA32U4.4 36.19,65.41 42.42,71.63 R4.1
N$11
  Top 0.305: C9.2 23.88,80.35 Y1.1 26.33,77.91 R6.1 26.73,75.29 ATMEGA32U4.17
N$12
  Top 0.305: 60.65,60.42 RX.ANODE
  Top 0.406: R20.1 60.65,60.42
N$13
  Top 0.305: BNCITC1.GND 55.63,48.51 57.66,46.48 57.66,44.96 55.88,43.18 55.88,33.02 54.86,31.75 R11.2
N$14
  Top 0.305: C19.2 45.89,35.73 45.72,35.56 46.18,35.56 AD8221.4 48.65,35.69 C22.2 50.79,35.81 R9.1
N$15
  Top 0.305: C5.1 42.89,79.08 42.55,78.74 42.55,74.93 41.02,73.41 41.02,72.14 35.88,66.99 ATMEGA32U4.6
N$16
  Top 0.305: R13.2 41.39,24.88 41.53,25.02 43.56,25.02 | 43.56,25.02 45.65,25.02 C29.2 | R14.1 43.66,24.92 43.56,25.02
N$17
  Top 0.305: 54.1,45.97 BNCITC1.S | 54.1,45.97 53.09,44.96 53.09,40.64 | 54.1,45.97 | 53.09,40.64 R10.2 | 53.09,40.64 53.09,36.16 R9.2
N$18
  Top 0.305: ADTL082-IC1.6 30.1,34.42 29.72,34.8 29.25,34.8 | R7.2 28.96,37.85 29.21,38.1 R8.2
  Top 0.406: R7.2 29.25,34.8
N$19  (via drill 0.6)
  Top 0.305: v48.77,69.85 R3.2 44.54,68.63 Z1.2
  Bottom 0.305: v48.77,69.85 48.77,72.9 49.69,73.82 X1.D-
N$20
  Top 0.305: ATMEGA32U4.3 36.4,64.59 41.66,69.85 R3.1
N$21
  Top 0.305: X1.D+ 55.86,72.63 54.86,71.63 R4.2 44.54,72.84 Z2.2
  Top 0.406: R4.2 44.55,71.64
N$22
  Top 0.813: X1.VBUS 53.88,80.99 53.09,81.79 52.15,81.79 F1.1
N$23
  Top 0.305: 47.48,18.84 ADTL082-IC2.7 | C29.1 45.47,17.91 45.75,17.62 ADTL082-IC2.6 48.35,17.62 48.39,17.65 48.39,18.8 48.26,18.92 47.56,18.92 47.48,18.84 | 47.48,18.84 53.85,18.84 BNCFOCUS1.S
N$24
  Top 0.305: 60.65,56.61 ON.ANODE
  Top 0.406: R21.1 60.65,56.61
N$25  (via drill 0.6)
  Top 0.305: C3.1 35.05,59.18 36.07,60.2 L1.1 | 32,59.48 C3.1 | 21.02,70.1 ATMEGA32U4.24 19.98,70.19 v18.8,71.37 | v30.48,63.5 30.73,63.25 ATMEGA32U4.44 30.88,61.19 31.75,60.33 31.75,59.22 C3.1
  Bottom 0.305: v18.8,71.37 22.61,71.37 v30.48,63.5
N$26
  Top 0.305: C11.2 30.47,80.35 Y1.2 28.03,77.91 R6.2 27.53,75.2 ATMEGA32U4.16
N$27
  Top 0.305: 1.72,61.81 3.56,61.81 R18.1
  Top 0.406: TX1.ANODE 1.72,61.81
N$28
  Top 0.508: 11.95,29.33 D3.1 12.16,29.34 | C30.A 9.37,29.33
  Top 0.61: 12.16,29.34 D2.2 | 9.37,29.33 D3.1
N$30
  Top 0.508: 4.53,25.12 C33.C
  Top 0.61: 7660.4 4.53,25.12
N$31
  Top 0.508: 8.34,25.1 C33.A | 7660.2 7.11,22.14
  Top 0.61: 8.34,25.1 7.11,23.88 7.11,22.14 | C33.A 8.46,25.76 C30.C
RESET  (via drill 0.6)
  Top 0.305: ATMEGA32U4.13 29.97,72.83 29.97,73.33 29.93,73.37 29.93,73.62 31.24,74.93 v34.29,74.93 | 48.77,61.04 D1.A 48.69,63.07 47.5,64.26 v44.96,64.26 | 51.08,55.88 RESET.1 50.8,56.16
  Top 0.406: D1.A 48.69,59.02 R1.2 49.84,56.16 50.8,56.16
  Bottom 0.305: ICSP.5 39.12,57.15 39.12,56.64 39.88,55.88 42.42,55.88 44.07,57.53 44.07,61.85 44.96,62.74 v44.96,64.26 v34.29,74.93
RXLED  (via drill 0.6)
  Top 0.305: RX.CATHODE 62.14,63.37 59.05,63.37 58.67,63.75 v58.67,64.52 | ATMEGA32U4.8 35.18,68.58 38.48,71.88 v38.48,72.52
  Bottom 0.305: v38.48,72.52 43.94,67.06 57.4,67.06 57.78,66.67 57.78,65.41 v58.67,64.52
SCK  (via drill 0.6)
  Top 0.305: 38.35,49.78 26.92,49.78 25.04,51.66 AD5531.7 | 38.35,49.78 38.61,49.78 40.39,51.56 40.39,53.59 37.21,56.64 37.21,59.18 37.85,59.82 ICSP.3 | AD7894-10.4 38.48,49.66 38.35,49.78 | ATMEGA32U4.9 34.21,69.39 v34.8,69.98
  Bottom 0.305: ICSP.3 37.08,61.98 35.31,61.98 34.8,62.48 v34.8,69.98
TSL1401R_A0
  Top 0.305: 9.02,45.59 U$1.AO 9,45.72 7.62,45.72 6.35,46.99 6.35,52.07 9.02,54.74 11.05,54.74 13.46,57.15 13.46,62.99 17.46,66.99 ATMEGA32U4.28
TSL1401R_CLK
  Top 0.305: ATMEGA32U4.30 17.77,65.39 14.99,62.61 14.99,50.42 14.1,49.53 10.79,49.53 9.52,48.26 9.04,48.26 U$1.CLK
TSL1401R_SI
  Top 0.305: U$1.SI 8.89,50.57 8.89,52.07 10.16,53.34 11.43,53.34 14.22,56.13 14.22,62.87 17.55,66.19 ATMEGA32U4.29
TXLED  (via drill 0.6)
  Top 0.305: v18.8,72.64 22.59,72.64 | v62.74,67.82 62.74,66.58
  Top 0.406: 22.59,72.64 ATMEGA32U4.22 | 62.74,66.58 TX.CATHODE
  Bottom 0.305: v62.74,67.82 62.74,82.04 61.47,83.31 19.81,83.31 18.8,82.3 v18.8,72.64
UGND
  Top 0.305: ATMEGA32U4.5 35.97,66.19 36.09,66.19 41.78,71.88 41.78,72.9 43.69,74.8 C5.2 45.72,77.38 L2.2 46.19,77.13 46.36,76.96 46.74,76.96 48.64,75.06 54.74,75.06 55.86,76.18 X1.GND

### Text on the board
tPlace: Karl Bellve, | Biomedical Imaging Group | Program in Molecular Medicine | University of Massachusetts Medical School | USB | 0 | 1 | 2 | 3 | 4 | 5 | 6 | 7 | 5V | GND | * | * | * | IN | * | * | OUT | * | * | +10V/-5V Power Supply | Karl.Bellve@umassmed.edu | Copyright 2013 | pgFocus
bPlace: Credits | Biomedical Imaging Group | Kevin Fogarty | Karl Bellve | Lawrence Lifshitz | Clive Standley | Collaborators | Silvia Corvera | Deborah Leonard | Mike Czech | Advice | Michael Brenegan | Special thanks | Arduino Team | Sparkfun Electronics | Adafruit Industries | Parallax Inc | Feb 5, 2013
bNames: Copyright 2013
bValues: Thank you
tDocu: Caps C24,C25,C38,C39 / might not need to be low ESR | Optional Cap (C35) | slows the OSC (pin 7)